# Altium schematic sheet AutomaticBacklight.SchDoc
size A4; PageSetup: Record=PageOptions|CenterHorizontal=True|CenterVertical=True|PrintScale=1.00|XCorrection=1.00|YCorrection=1.00|PrintKind=0|BorderSize=5000000|LeftOffset=0|BottomOffset=0|Orientation=2|PaperLength=1000|PaperWidth=1000|Scale=100|PaperSource=7|PrintQuality=-3|MediaType=1|DitherType=10|PrintScaleMode=1|PaperKind=A4|PaperIndex=9
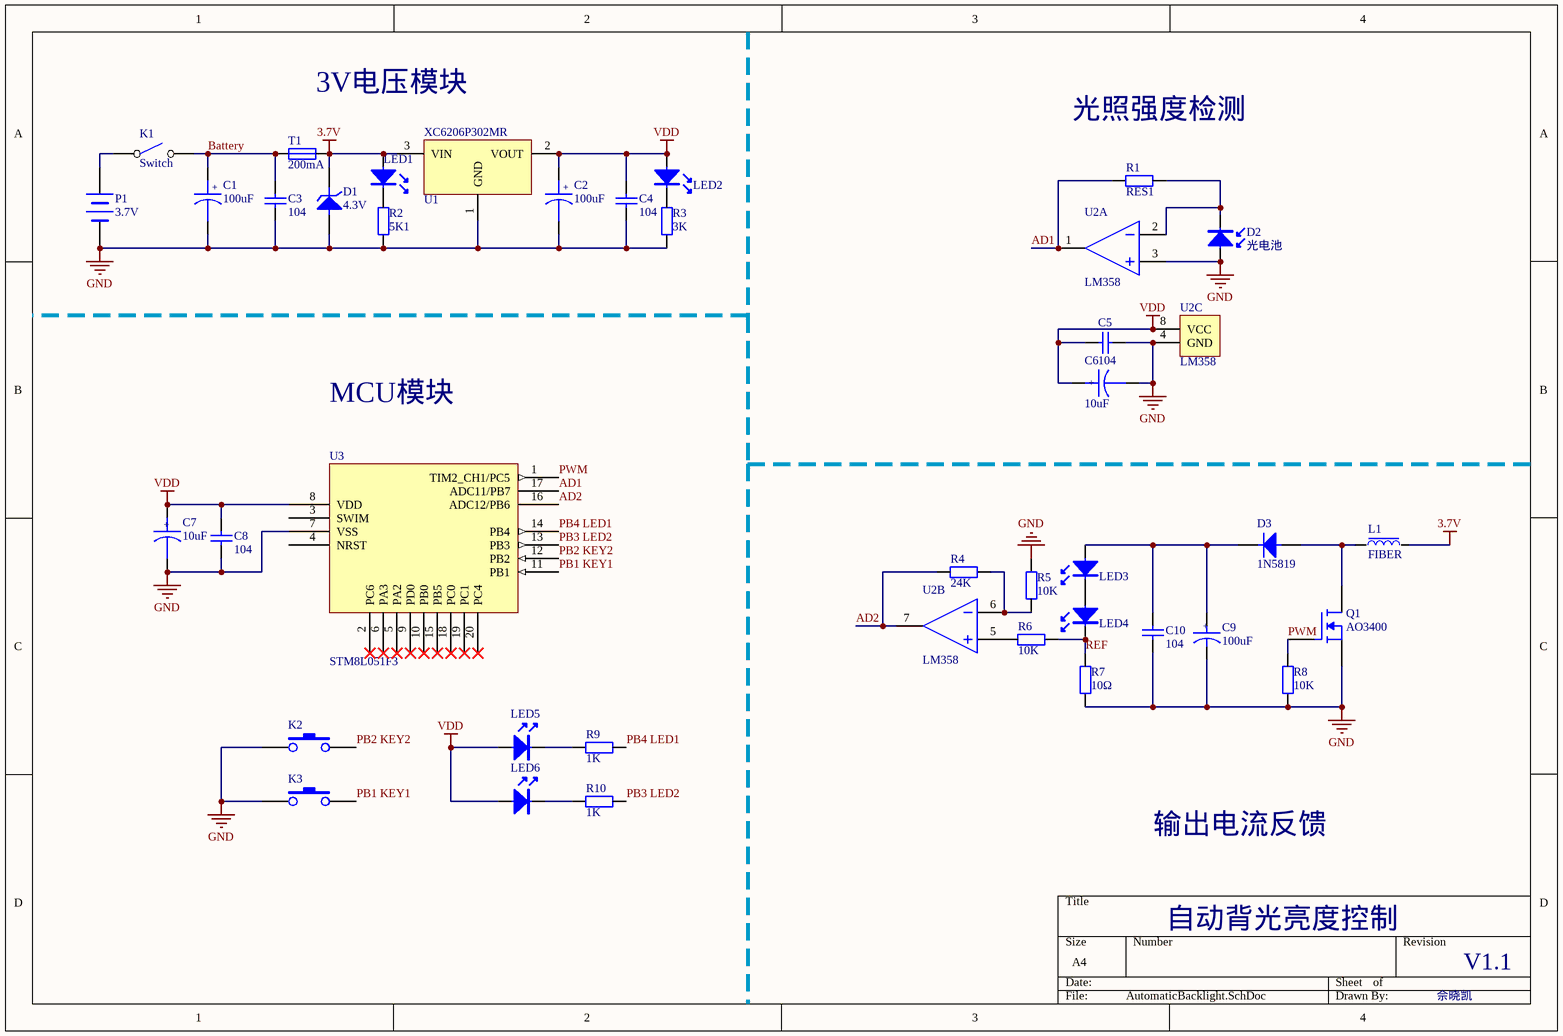
[diagram p0: AutomaticBacklight.SchDoc]

## Parts
C1  100uF
C2  100uF
C3  104  [0805C]
C4  104  [0805C]
C5  104  [0805C]
C6  10uF
C7  10uF
C8  104  [0805C]
C9  100uF
C10  104  [0805C]
D1  4.3V
D2  光电池
D3  1N5819
K1  Switch  [Switch1]
K2  Botton  (value not drawn)
K3  Botton  (value not drawn)
L1  FIBER
LED1  LED  (value not drawn)
LED2  LED  (value not drawn)
LED3  LED  (value not drawn)
LED4  LED  (value not drawn)
LED5  LED  (value not drawn)
LED6  LED  (value not drawn)
P1  3.7V
Q1  AO3400
R1  RES1
R2  5K1
R3  3K
R4  24K
R5  10K
R6  10K
R7  10Ω
R8  10K
R9  1K
R10  1K
T1  200mA
U1  XC6206P302MR
U2  LM358  (parts A,B,C of 3)
U3  STM8L051F3

## Nets
3.7V: D1.K L1.1 LED1.A T1.2 U1.3(VIN)
GND: C1.K C2.K C3.1 C4.2 C5.2 C6.K C7.K C8.2 C9.K C10.2 D1.A D2.A K2.1 K3.1 P1.2(-) Q1.3(S) R2.1 R3.1 R5.1 R7.1 R8.1 U1.1(GND) U2.3(IN+) U2.4(GND) U3.7(VSS)
VDD: C2.A C4.1 C5.1 C6.A C7.A C8.1 LED2.A LED5.A LED6.A U1.2(VOUT) U2.8(VCC) U3.8(VDD)
AD1: R1.1 U2.1(OUT) U3.17(ADC11/PB7)
AD2: R4.2 U2.7(OUT) U3.16(ADC12/PB6)
Battery: C1.A C3.2 K1.2 T1.1
PB1 KEY1: K3.2 U3.11(PB1)
PB2 KEY2: K2.2 U3.12(PB2)
PB3 LED2: R10.2 U3.13(PB3)
PB4 LED1: R9.2 U3.14(PB4)
PWM: Q1.1(G) R8.2 U3.1(TIM2_CH1/PC5)
REF: LED4.K R6.1 R7.2
NetC9_A: C9.A C10.1 D3.K LED3.A
NetD2_K: D2.K R1.2 U2.2(IN-)
NetD3_A: D3.A L1.2 Q1.2(D)
NetK1_1: K1.1 P1.1(+)
NetLED3_K: LED3.K LED4.A
NetLED5_K: LED5.K R9.1
NetLED6_K: LED6.K R10.1
NetR4_1: R4.1 R5.2 U2.6(IN-)
NetR6_2: R6.2 U2.5(IN+)

Not connected (* = marked no-connect by the designer): LED1 K(2); LED2 K(2); R2 2; R3 2; U3 2(PC6)* 3(SWIM) 4(NRST) 5(PA2)* 6(PA3)* 9(PD0)* 10(PB0)* 15(PB5)* 18(PC0)* 19(PC1)* 20(PC4)*

## Notes on the sheet
- 3V电压模块
- 光照强度检测
- MCU模块
- 输出电流反馈
- 自动背光亮度控制
- V1.1
- 佘晓凯
- (in symbol Cap2) +

## Library data of the parts
C1 C2 C6 C7 C9 = Cap2: 电解电容
C3-C5 C8 C10 = Cap1: 无极性电容
D1 = StabilivoltDiode: 稳压二极管
D2 = LightCell
D3 = DIODE: 二极管
K1 = Switch: 开关
P1 = Battery: 电池
Q1 = NMOS(增强型)
R2-R10 = RES1
T1 = InsurancePipe: 保险管
U1 = XC6206: SOT-23封装
U2 = LM358: 运算放大器